# Altium schematic sheet MIDDLE LAYER.SchDoc
size A
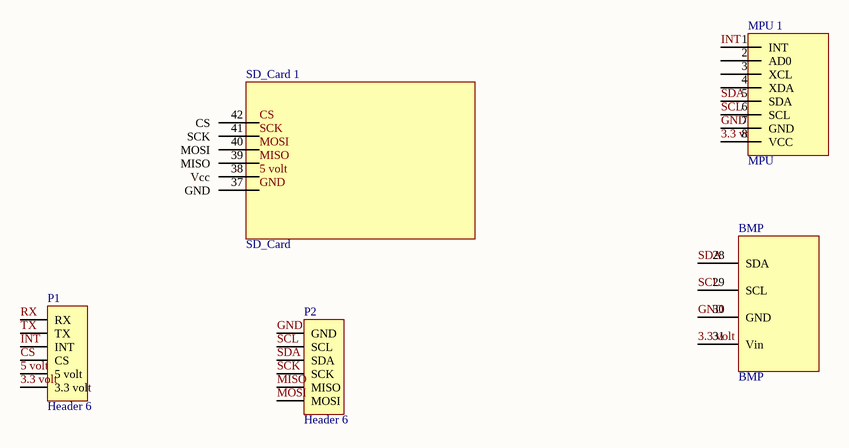
[diagram p0: MIDDLE LAYER.SchDoc]

## Parts
BMP  BMP  [BMP]
MPU_1  MPU  [MPU]
P1  Header 6  [HDR1X6]
P2  Header 6  [HDR1X6]
SD_Card_1  SD_Card  [SD_Card]

## Nets
3.3 volt: BMP.31(Vin) MPU_1.8(VCC) P1.6(3.3_volt)
5 volt: P1.5(5_volt) SD_Card_1.38(Vcc)
CS: P1.4(CS) SD_Card_1.42(CS)
GND: BMP.30(GND) MPU_1.7(GND) P2.1(GND) SD_Card_1.37(GND)
INT: MPU_1.1(INT) P1.3(INT)
MISO: P2.5(MISO) SD_Card_1.39(MISO)
MOSI: P2.6(MOSI) SD_Card_1.40(MOSI)
RX: P1.1(RX)
SCK: P2.4(SCK) SD_Card_1.41(SCK)
SCL: BMP.29(SCL) MPU_1.6(SCL) P2.2(SCL)
SDA: BMP.28(SDA) MPU_1.5(SDA) P2.3(SDA)
TX: P1.2(TX)

Not connected (* = marked no-connect by the designer): MPU_1 2(AD0) 3(XCL) 4(XDA)

## Library data of the parts
P1 P2 = Header 6: Header, 6-Pin; LatestRevisionDate: 17-Jul-2002; LatestRevisionNote: Re-released for DXP Platform.; Publisher: Altium Limited